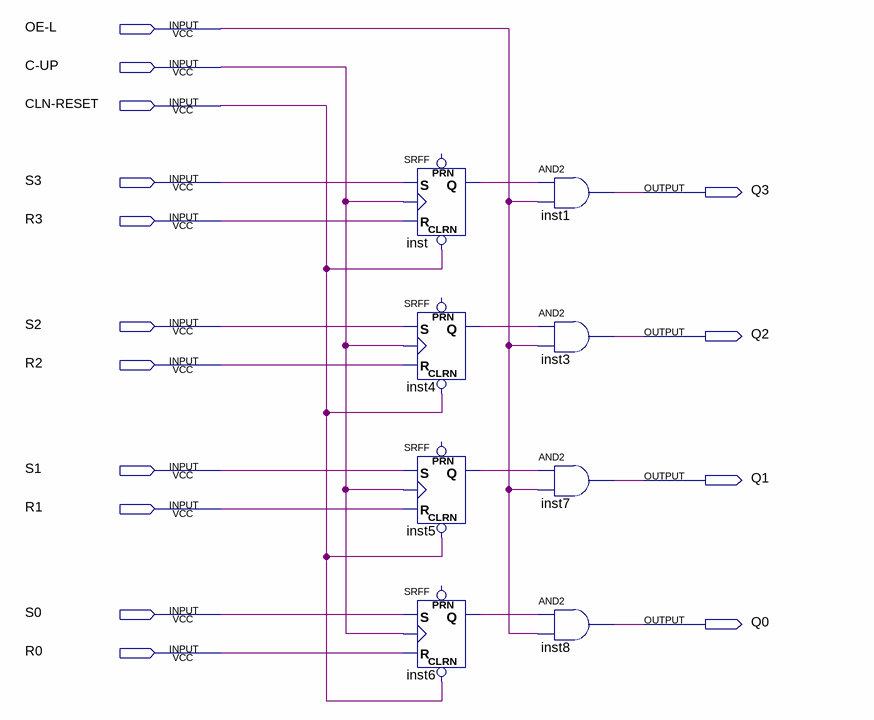
[diagram p0: schematic sheet]
// Quartus schematic Laboratory_work_5_1_project.bdf as structural Verilog: 8 symbols, 15 pins
module Laboratory_work_5_1_project (
  input  \OE-L ,
  input  \C-UP ,
  input  \CLN-RESET ,
  input  S3,
  input  R3,
  input  S2,
  input  R2,
  input  S1,
  input  R1,
  input  S0,
  input  R0,
  output Q3,
  output Q2,
  output Q1,
  output Q0
);

  wire inst4_q, inst5_q, inst6_q, inst_q;

  SRFF inst (.CLRN(\CLN-RESET ), .S(S3), .R(R3), .CLK(\C-UP ), .Q(inst_q));  // open: PRN
  SRFF inst4 (.CLRN(\CLN-RESET ), .S(S2), .R(R2), .CLK(\C-UP ), .Q(inst4_q));  // open: PRN
  SRFF inst5 (.CLRN(\CLN-RESET ), .S(S1), .R(R1), .CLK(\C-UP ), .Q(inst5_q));  // open: PRN
  SRFF inst6 (.CLRN(\CLN-RESET ), .S(S0), .R(R0), .CLK(\C-UP ), .Q(inst6_q));  // open: PRN
  and inst1 (Q3, inst_q, \OE-L );
  and inst3 (Q2, inst4_q, \OE-L );
  and inst7 (Q1, inst5_q, \OE-L );
  and inst8 (Q0, inst6_q, \OE-L );
endmodule
